# EAGLE design feather adapter (EAGLE 9.2.2)
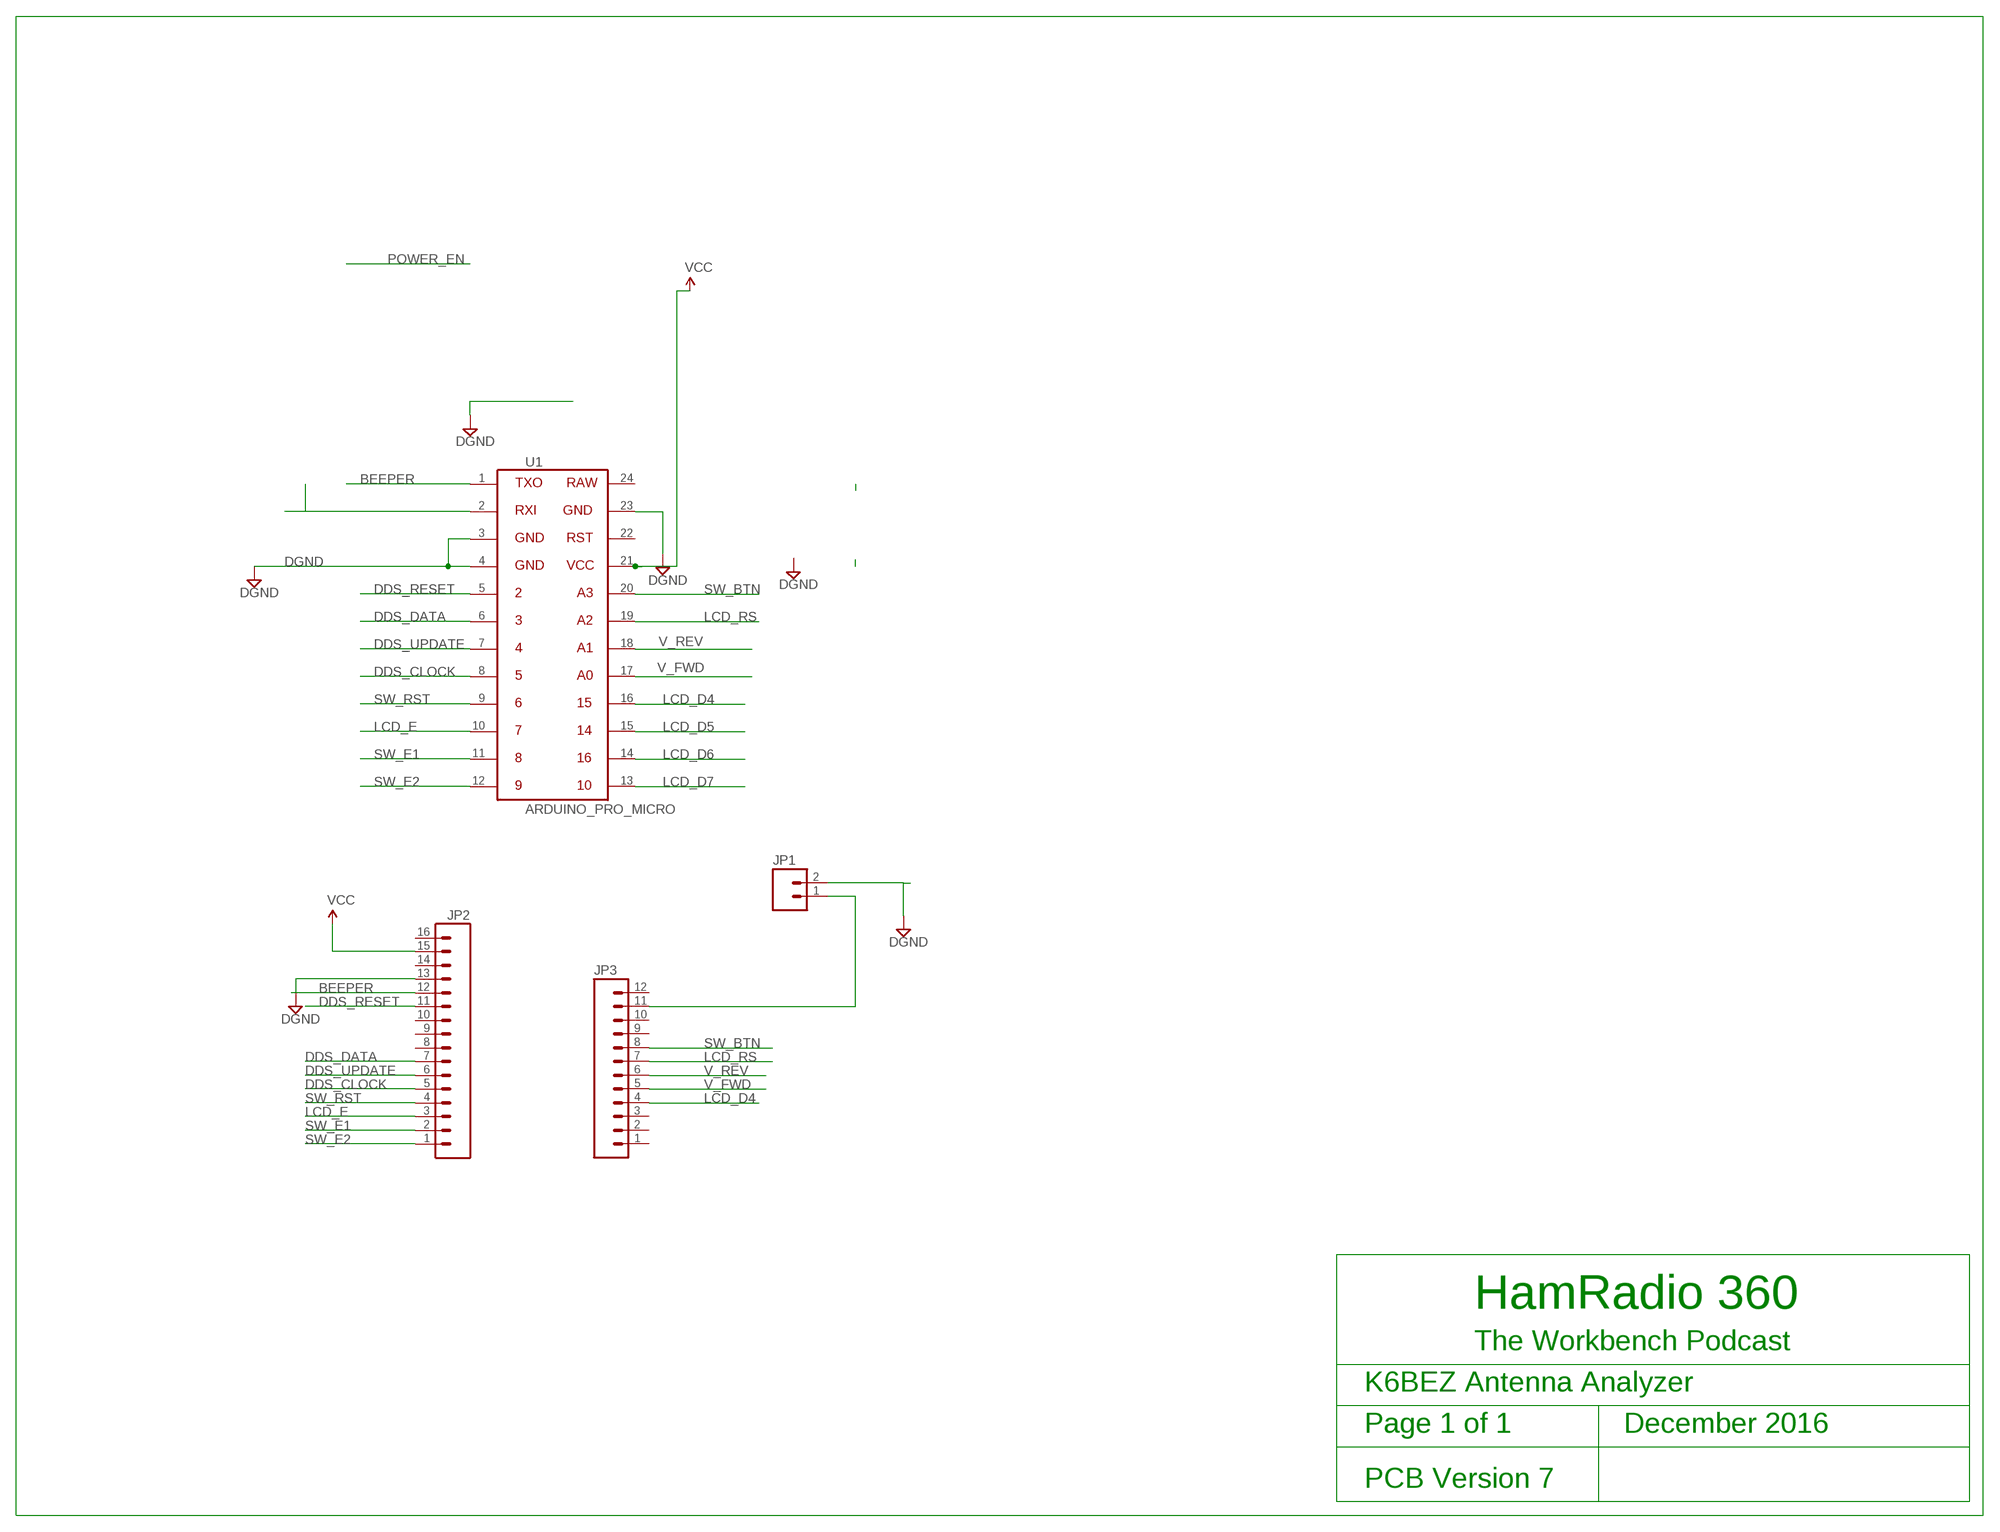
[diagram p0: schematic, sheet 1]

## Parts
JP1  M02PTH  [1X02]
JP2  M16PTH  [1X16]
JP3  M12PTH  [1X12]
U1  ARDUINO_PRO_MICRO  [ARDUINO_PRO_MICRO]

## Nets
BEEPER: JP2.12 U1.1
DDS_CLOCK: JP2.5 U1.8
DDS_DATA: JP2.7 U1.6
DDS_RESET: JP2.11 U1.5
DDS_UPDATE: JP2.6 U1.7
DGND: JP1.2 JP2.13 U1.3 U1.4 U1.23
LCD_D4: JP3.4 U1.16
LCD_D5: U1.15
LCD_D6: U1.14
LCD_D7: U1.13
LCD_E: JP2.3 U1.10
LCD_RS: JP3.7 U1.19
N$1: JP1.1 JP3.11
N$8: U1.2
SW_BTN: JP3.8 U1.20
SW_E1: JP2.2 U1.11
SW_E2: JP2.1 U1.12
SW_RST: JP2.4 U1.9
V_FWD: JP3.5 U1.17
V_REV: JP3.6 U1.18
VCC: JP2.15 U1.21
Unconnected: JP2.8 JP2.9 JP2.10 JP2.14 JP2.16 JP3.1 JP3.2 JP3.3 JP3.9 JP3.10 JP3.12 U1.22 U1.24

## Notes on the sheet
- HamRadio 360
- The Workbench Podcast
- K6BEZ Antenna Analyzer
- Page 1 of 1              December 2016
- PCB Version 7

## Library data of the parts
JP1 = SparkFun-Connectors:M02: Standard 2-pin 0.1" header. Use with - straight break away headers ( PRT-00116) - right angle break away headers (PRT-00553) - swiss pins (PRT-00743) - machine pins (PRT-00117) - female headers (PRT-00115) Molex polarized connector foot print use with: PRT-08233 with associated crimp pins and housings. 2.54_SCREWTERM for use with PRT-10571. 3.5mm Screw Terminal footprints for PRT-08084 5mm Screw Terminal footprints for use with PRT-08432
JP2 = SparkFun-Connectors:M16: 1x16 .1" header
JP3 = SparkFun-Connectors:M12: Header 12 Standard 12-pin 0.1" header. Use with straight break away headers (SKU : PRT-00116), right angle break away headers (PRT-00553), swiss pins (PRT-00743), machine pins (PRT-00117), and female headers (PRT-00115).
U1 = srs_lib_4:ARDUINO_PRO_MICRO

## Board
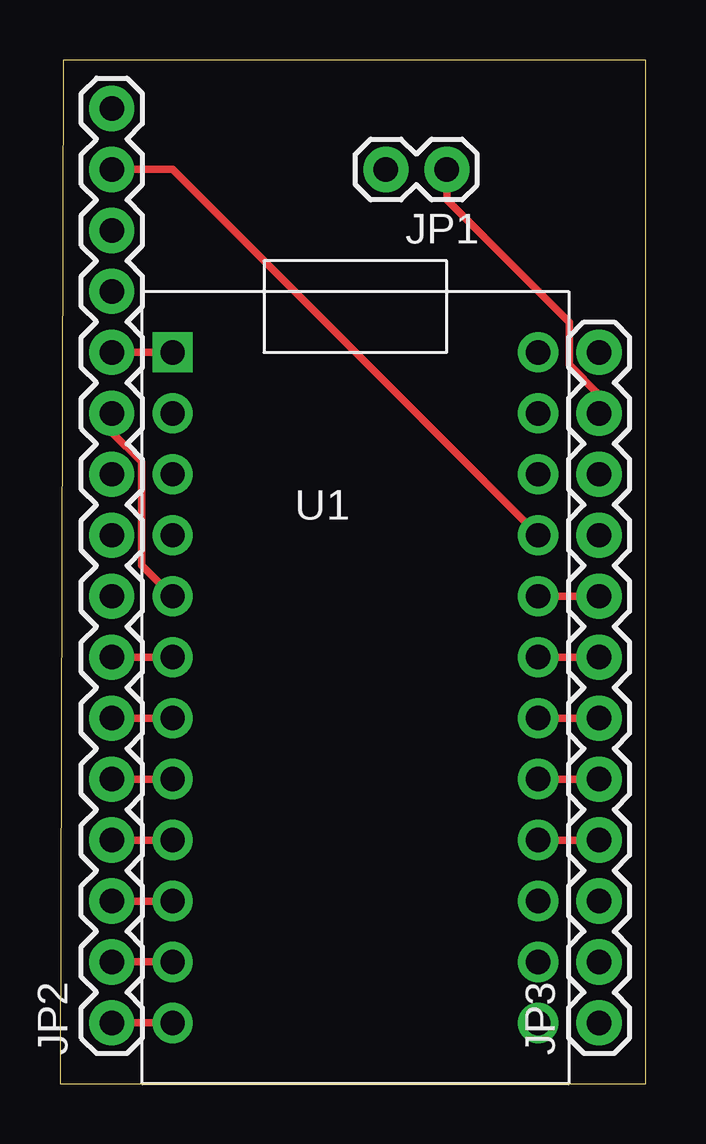
[diagram p1: board, top side]
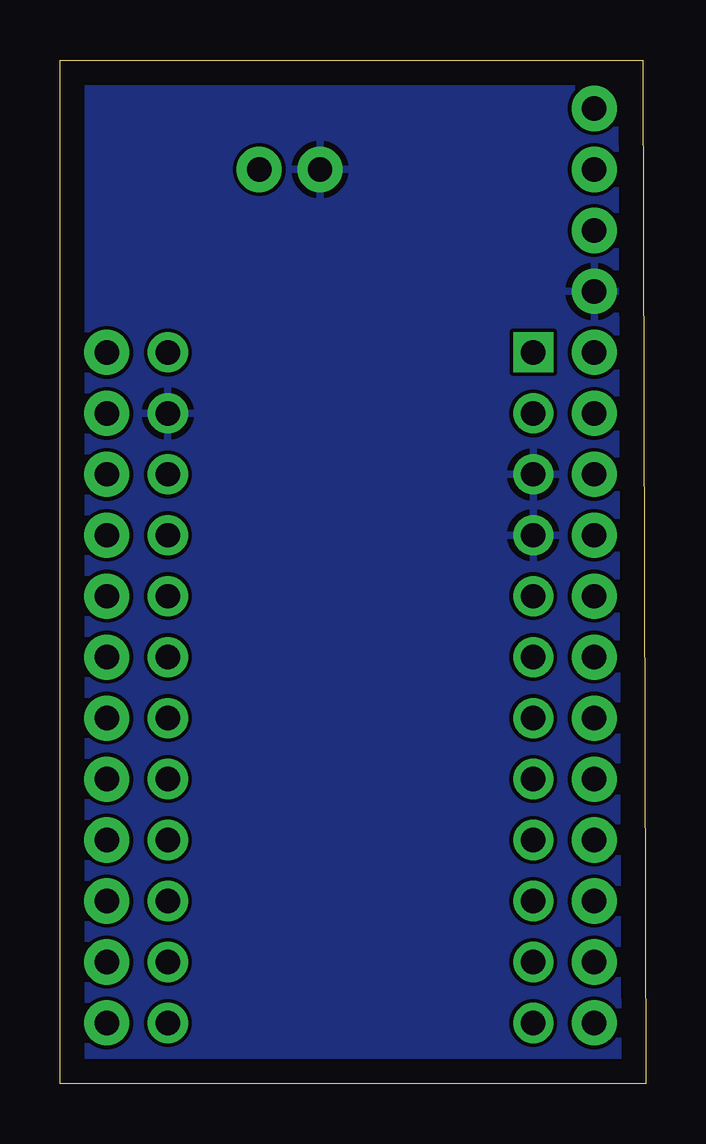
[diagram p2: board, bottom side, seen from below]

Size 24.43 x 42.66 mm. Coordinates in mm from the lower left corner, seen from the top.
Outline: 0,0 24.43,0 24.43,42.66 0.13,42.66 0,0
Copper layers (1*16): Top 0.035mm / dielectric 1.5mm / Bottom 0.035mm
Design rules "default": minimum track width 6mil, minimum drill 0.35mm, track to track 6mil, track to pad 6mil, pad to pad 6mil, via to via 6mil, smd to smd 6mil, copper to edge 40mil, drill to drill 6mil, minimum pad ring 10mil, minimum via ring 8mil, stop-mask expansion 4mil, vias tented up to drill 0mil, thermal gap 10mil

### Footprints (pad centres in the part's own frame; a part is rotated, then mirrored left to right if it is on the bottom)
1X02 = drill 1.016 pad 1.88: 1 0,0; 2 2.54,0
1X16 = drill 1.016 pad 1.88: 1 0,0; 2 2.54,0; 3 5.08,0; 4 7.62,0; 5 10.16,0; 6 12.7,0; 7 15.24,0; 8 17.78,0; 9 20.32,0; 10 22.86,0; 11 25.4,0; 12 27.94,0; 13 30.48,0; 14 33.02,0; 15 35.56,0; 16 38.1,0
1X12 = drill 1.016 pad 1.88: 1 0,0; 2 2.54,0; 3 5.08,0; 4 7.62,0; 5 10.16,0; 6 12.7,0; 7 15.24,0; 8 17.78,0; 9 20.32,0; 10 22.86,0; 11 25.4,0; 12 27.94,0
ARDUINO_PRO_MICRO = drill 1.016 pad 1.676 square: 1 0,0 | drill 1.016 pad 1.676: 2 0,-2.54; 3 0,-5.08; 4 0,-7.62; 5 0,-10.16; 6 0,-12.7; 7 0,-15.24; 8 0,-17.78; 9 0,-20.32; 10 0,-22.86; 11 0,-25.4; 12 0,-27.94; 13 15.24,-27.94; 14 15.24,-25.4; 15 15.24,-22.86; 16 15.24,-20.32; 17 15.24,-17.78; 18 15.24,-15.24; 19 15.24,-12.7; 20 15.24,-10.16; 21 15.24,-7.62; 22 15.24,-5.08; 23 15.24,-2.54; 24 15.24,0

### Placement (x,y rotation side)
JP1  16.13,38.1 180 top
JP2  2.16,2.54 90 top
JP3  22.48,2.54 90 top
U1  4.7,30.48 0 top

### Tracks (layer width: path | path; a pad name or v marks a point on that pad's centre or on a via)
BEEPER
  Top 0.305: U1.1 JP2.12
DDS_CLOCK
  Top 0.305: U1.8 JP2.5
DDS_DATA
  Top 0.305: U1.6 JP2.7
DDS_RESET
  Top 0.305: JP2.11 2.16,27.16 3.4,25.92 3.4,21.61 U1.5
DDS_UPDATE
  Top 0.305: JP2.6 U1.7
DGND
  pour Bottom: 0.89,0 0.89,41.91 23.75,41.91 23.75,0
LCD_D4
  Top 0.305: U1.16 JP3.4
LCD_E
  Top 0.305: U1.10 JP2.3
LCD_RS
  Top 0.305: JP3.7 U1.19
N$1
  Top 0.305: JP3.11 22.48,28.72 21.23,29.96 21.23,31.73 16.13,36.83 JP1.1
SW_BTN
  Top 0.305: U1.20 JP3.8
SW_E1
  Top 0.305: JP2.2 U1.11
SW_E2
  Top 0.305: U1.12 JP2.1
SW_RST
  Top 0.305: JP2.4 U1.9
V_FWD
  Top 0.305: JP3.5 U1.17
V_REV
  Top 0.305: U1.18 JP3.6
VCC
  Top 0.305: U1.21 4.7,38.1 JP2.15